# Altium schematic sheet Kajtuś-DSP_processor.SchDoc
size A4; DocumentNumber: 8; SheetNumber: 8; SheetTotal: 9
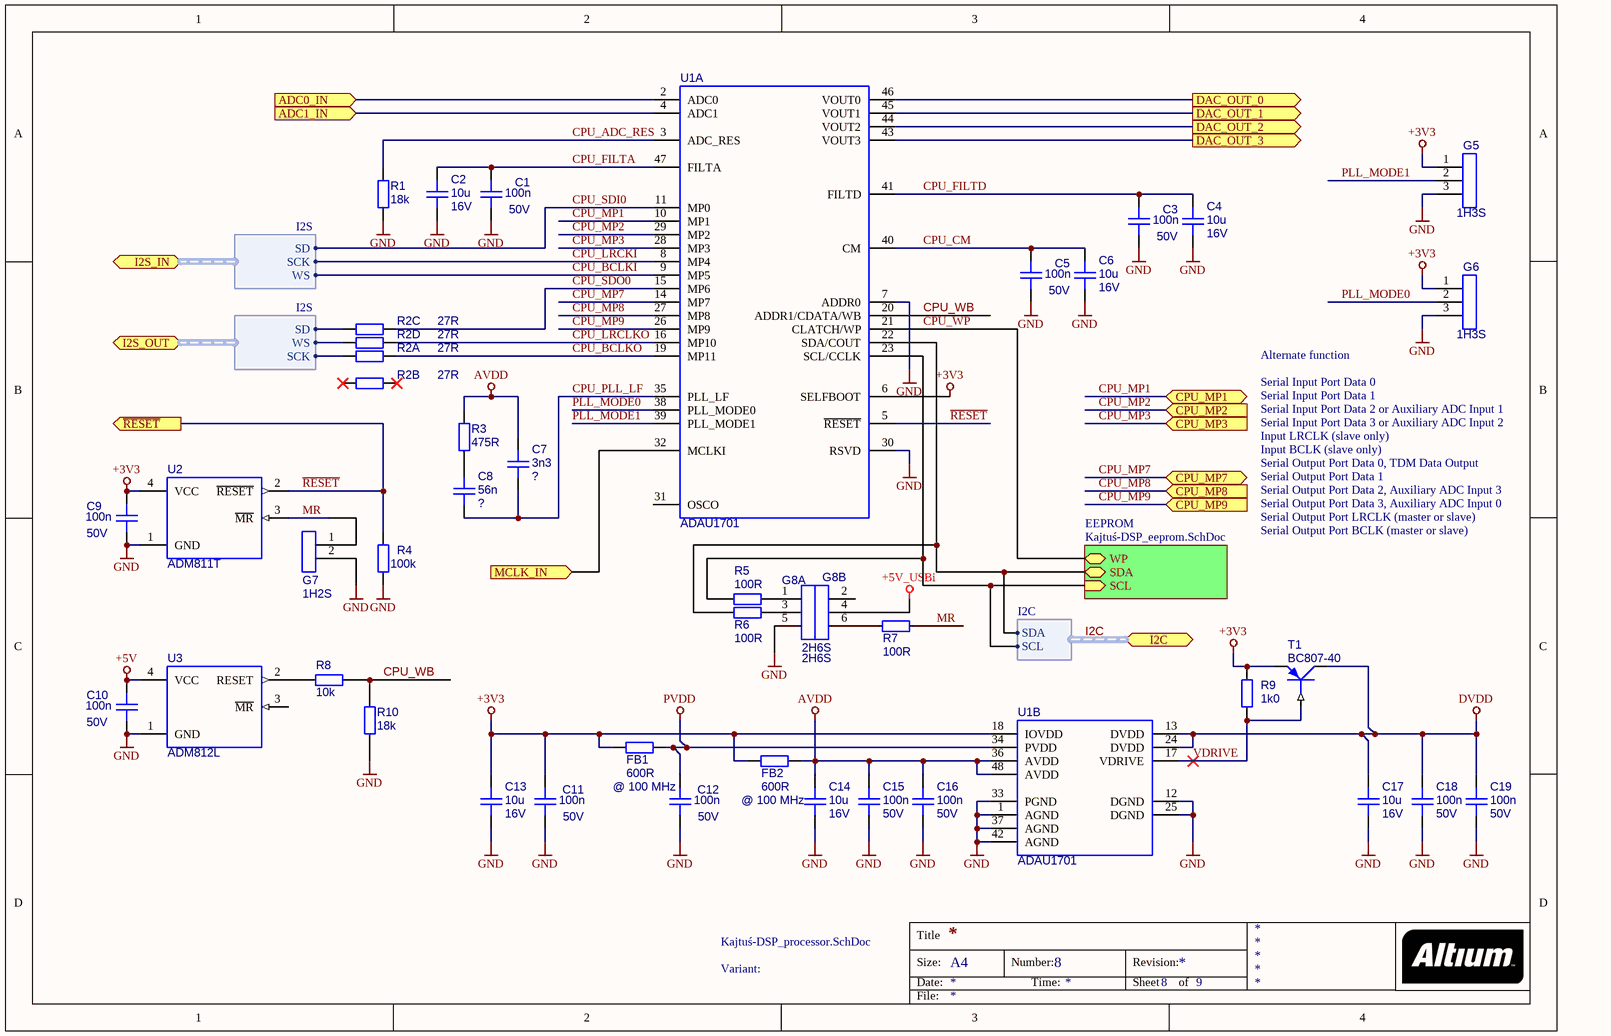
[diagram p0: Kajtuś-DSP_processor.SchDoc]

## Parts
C1  value 100n  Voltage: 50V  [C_0603_MA]  (hidden comment: C_0603_100n_50V_X7R)
C2  value 10u  Voltage: 16V  [C_0805_MA]  (hidden comment: C_0805_10u_16V_X5R)
C3  value 100n  Voltage: 50V  [C_0603_MA]  (hidden comment: C_0603_100n_50V_X7R)
C4  value 10u  Voltage: 16V  [C_0805_MA]  (hidden comment: C_0805_10u_16V_X5R)
C5  value 100n  Voltage: 50V  [C_0603_MA]  (hidden comment: C_0603_100n_50V_X7R)
C6  value 10u  Voltage: 16V  [C_0805_MA]  (hidden comment: C_0805_10u_16V_X5R)
C7  3n3  [C_0603_MA]
C8  56n  [C_0603_MA]
C9  value 100n  Voltage: 50V  [C_0603_MA]  (hidden comment: C_0603_100n_50V_X7R)
C10  value 100n  Voltage: 50V  [C_0603_MA]  (hidden comment: C_0603_100n_50V_X7R)
C11  value 100n  Voltage: 50V  [C_0603_MA]  (hidden comment: C_0603_100n_50V_X7R)
C12  value 100n  Voltage: 50V  [C_0603_MA]  (hidden comment: C_0603_100n_50V_X7R)
C13  value 10u  Voltage: 16V  [C_0805_MA]  (hidden comment: C_0805_10u_16V_X5R)
C14  value 10u  Voltage: 16V  [C_0805_MA]  (hidden comment: C_0805_10u_16V_X5R)
C15  value 100n  Voltage: 50V  [C_0603_MA]  (hidden comment: C_0603_100n_50V_X7R)
C16  value 100n  Voltage: 50V  [C_0603_MA]  (hidden comment: C_0603_100n_50V_X7R)
C17  value 10u  Voltage: 16V  [C_0805_MA]  (hidden comment: C_0805_10u_16V_X5R)
C18  value 100n  Voltage: 50V  [C_0603_MA]  (hidden comment: C_0603_100n_50V_X7R)
C19  value 100n  Voltage: 50V  [C_0603_MA]  (hidden comment: C_0603_100n_50V_X7R)
FB1  value 600R  @ Frequency: @ 100 MHz  [R_0603_MA]  (hidden comment: FB_0603_PBY160808T-601Y_600R_1A)
FB2  value 600R  @ Frequency: @ 100 MHz  [R_0603_MA]  (hidden comment: FB_0603_PBY160808T-601Y_600R_1A)
G5  value 1H3S  [1H3S_FHS]  (hidden comment: G_1H3S)
G6  value 1H3S  [1H3S_FHS]  (hidden comment: G_1H3S)
G7  value 1H2S  [1H2S_FHS]  (hidden comment: G_1H2S)
G8  value 2H6S  [2H6S]  (hidden comment: G_2H6S)  (parts A,B of 2)
R1  18k  [R_1206_MA]
R2  27R  [RA_1206]  (parts A,B,C,D of 4)
R3  475R  [R_0603_MA]
R4  value 100k  [R_0603_MA]  (hidden comment: R_0603_100k_5%)
R5  value 100R  [R_0603_MA]  (hidden comment: R_0603_100R_5%)
R6  value 100R  [R_0603_MA]  (hidden comment: R_0603_100R_5%)
R7  value 100R  [R_0603_MA]  (hidden comment: R_0603_100R_5%)
R8  value 10k  [R_0603_MA]  (hidden comment: R_0603_10k_5%)
R9  value 1k0  [R_0603_MA]  (hidden comment: R_0603_1k0_5%)
R10  18k  [R_0603_MA]
T1  BC807-40  [SOT-23]
U1  ADAU1701  [TSQFP50P900X900X160-48N]  (parts A,B of 2)
U2  ADM811T  [SOT-143]
U3  ADM812L  [SOT-143]

## Sub-sheets
EEPROM = Kajtuś-DSP_eeprom.SchDoc: SCL (in), SDA (bidir), WP (bidir)

## Ports
ADC0_IN (in), ADC1_IN (in), CPU_MP1, CPU_MP2 (in), CPU_MP3 (in), CPU_MP7, CPU_MP8 (in), CPU_MP9 (in), DAC_OUT_0 (out), DAC_OUT_1 (out), DAC_OUT_2 (out), DAC_OUT_3 (out), I2C (harness I2C), I2S_IN (harness I2S), I2S_OUT (harness I2S), MCLK_IN (in), ~{RESET} (out)

## Harnesses
I2S: SD, SCK, WS
I2C: SDA, SCL

## Nets
+3V3: C9.1 C11.1 C13.1 FB1.1 FB2.1 G5.1 G6.1 R9.1 T1.2(E) U1.6(SELFBOOT) U1.18(IOVDD) U2.4(VCC)
+5V: C10.1 U3.4(VCC)
+5V_USBi: G8.4
AVDD: C7.1 C14.1 C15.1 C16.1 FB2.2 R3.1 U1.36(AVDD) U1.48(AVDD)
DVDD: C17.1 C18.1 C19.1 T1.3(C) U1.13(DVDD) U1.24(DVDD)
GND: C1.2 C2.2 C3.2 C4.2 C5.2 C6.2 C9.2 C10.2 C11.2 C12.2 C13.2 C14.2 C15.2 C16.2 C17.2 C18.2 C19.2 G5.3 G6.3 G7.2 G8.5 R1.2 R4.2 R10.2 U1.1(AGND) U1.7(ADDR0) U1.12(DGND) U1.25(DGND) U1.30(RSVD) U1.33(PGND) U1.37(AGND) U1.42(AGND) U2.1(GND) U3.1(GND)
PVDD: C12.1 FB1.2 U1.34(PVDD)
ADC0_IN: U1.2(ADC0) ; port ADC0_IN
ADC1_IN: U1.4(ADC1) ; port ADC1_IN
CPU_ADC_RES: R1.1 U1.3(ADC_RES)
CPU_BCLKI: U1.9(MP5) ; port I2S_IN.WS
CPU_BCLKO: R2.5 U1.19(MP11)
CPU_CM: C5.1 C6.1 U1.40(CM)
CPU_FILTA: C1.1 C2.1 U1.47(FILTA)
CPU_FILTD: C3.1 C4.1 U1.41(FILTD)
CPU_LRCKI: U1.8(MP4) ; port I2S_IN.SCK
CPU_LRCLKO: R2.8 U1.16(MP10)
CPU_MP1: U1.10(MP1) ; port CPU_MP1
CPU_MP2: U1.29(MP2) ; port CPU_MP2
CPU_MP3: U1.28(MP3) ; port CPU_MP3
CPU_MP7: U1.14(MP7) ; port CPU_MP7
CPU_MP8: U1.27(MP8) ; port CPU_MP8
CPU_MP9: U1.26(MP9) ; port CPU_MP9
CPU_PLL_LF: C7.2 C8.2 U1.35(PLL_LF)
CPU_SDI0: U1.11(MP0) ; port I2S_IN.SD
CPU_SDO0: R2.7 U1.15(MP6)
CPU_WB: R8.2 R10.1 U1.20(ADDR1/CDATA/WB)
CPU_WP: U1.21(CLATCH/WP) ; sheet EEPROM/WP
DAC_OUT_0: U1.46(VOUT0) ; port DAC_OUT_0
DAC_OUT_1: U1.45(VOUT1) ; port DAC_OUT_1
DAC_OUT_2: U1.44(VOUT2) ; port DAC_OUT_2
DAC_OUT_3: U1.43(VOUT3) ; port DAC_OUT_3
I2C.SCL: R5.1 U1.23(SCL/CCLK) ; sheet EEPROM/SCL, port I2C.SCL
I2C.SDA: R6.1 U1.22(SDA/COUT) ; sheet EEPROM/SDA, port I2C.SDA
MCLK_IN: U1.32(MCLKI) ; port MCLK_IN
MR: G7.1 R7.2 U2.3(~{MR})
PLL_MODE0: G6.2 U1.38(PLL_MODE0)
PLL_MODE1: G5.2 U1.39(PLL_MODE1)
~{RESET}: R4.1 U1.5(~{RESET}) U2.2(~{RESET}) ; port ~{RESET}
VDRIVE: R9.2 T1.1(B) U1.17(VDRIVE)
NetC8_1: C8.1 R3.2
NetG8_1: G8.1 R5.2
NetG8_3: G8.3 R6.2
NetG8_6: G8.6 R7.1
NetR2_1: R2.1 ; port I2S_OUT.SCK
NetR2_3: R2.3 ; port I2S_OUT.SD
NetR2_4: R2.4 ; port I2S_OUT.WS
NetR8_1: R8.1 U3.2(RESET)

Not connected (* = marked no-connect by the designer): G8 2; R2 2* 6*; U1 31(OSCO); U3 3(~{MR})

## Buses and harness runs
harness I2C = port I2C

## Notes on the sheet
- Serial Input Port Data 0
- Alternate function
- Serial Input Port Data 1
- Serial Input Port Data 2 or Auxiliary ADC Input 1
- Serial Input Port Data 3 or Auxiliary ADC Input 2
- Input LRCLK (slave only)
- Input BCLK (slave only)
- Serial Output Port Data 0, TDM Data Output
- Serial Output Port Data 1
- Serial Output Port Data 2, Auxiliary ADC Input 3
- Serial Output Port Data 3, Auxiliary ADC Input 0
- Serial Output Port LRCLK (master or slave)
- Serial Output Port BCLK (master or slave)
- Variant:
- Title
- Size:
- Date:
- A4
- Number:
- Time:
- Revision:
- Sheet
- of
- File:

## Library data of the parts
C1 C3 C5 C9-C12 C15 C16 C18 C19 = C_0603_100n_50V_X7R: Kondensator ceramiczny SMD; Vendor: TME; Part Number: C_0603_100n_50V_X7R
C2 C4 C6 C13 C14 C17 = C_0805_10u_16V_X5R: Kondensator ceramiczny SMD; Vendor: TME; Part Number: C_0805_10u_16V_X5R
C7 C8 = C_SMD_MLCC_generic: Kondensator ceramiczny SMD; Vendor: ?; Part Number: C_SMD_MLCC_generic; Voltage: ?
  C7: Value: 3n3
  C8: Value: 56n
FB1 FB2 = FB_0603_PBY160808T-601Y_600R_1A: Koralik ferrytowy; Manufacturer: Yageo; Vendor: TME; Part Number: FB_0603_PBY160808T-601Y_600R_1A; Vendor Part Name: PBY160808T-601Y; Manufacturer Part Number: PBY160808T-601Y
G5 G6 = G_1H3S: Listwa jednorzędowa, 1x3 piny, raster 2,54mm; Manufacturer: generic; Vendor: TME; Part Number: G_1H3S
G7 = G_1H2S: Listwa jednorzędowa, 1x2 piny, raster 2,54mm; Manufacturer: generic; Vendor: TME; Part Number: G_1H2S
G8 = G_2H6S: Listwa kołkowa; Manufacturer: Ninigi; Vendor: TME; Part Number: G_2H6S
R1 R3 R10 = R_SMD_generic: SMD resistor; Part Number: ?; Vendor: ?; Manufacturer: ?; Tolerance: ?
  R1 R10: Value: 18k
  R3: Value: 475R
R2 = RA_1206_4x27R_5%: SMD Resistor Array, 1206, 4x27R, 5%, 62.5mW; Parametry: 4x27R; 5%; 1/16W;; Producent: Yageo; Oznaczenie: YC164-JR0727RL; TCR: 200ppm; Package: 1206, YC164; Tolerance: 5%; Value: 27R
R4 = R_0603_100k_5%: Rezystor SMD; Manufacturer: Royal Ohm; Vendor: TME; Tolerance: 5%; Part Number: R_0603_100k_5%
R5-R7 = R_0603_100R_5%: Rezystor SMD; Manufacturer: Royal Ohm; Vendor: TME; Tolerance: 5%; Part Number: R_0603_100R_5%
R8 = R_0603_10k_5%: Rezystor SMD; Manufacturer: Royal Ohm; Vendor: TME; Tolerance: 5%; Part Number: R_0603_10k_5%
R9 = R_0603_1k0_5%: Rezystor SMD; Manufacturer: Royal Ohm; Vendor: TME; Tolerance: 5%; Part Number: R_0603_1k0_5%
T1 = T_SOT-23_BC807-40: Tranzystor bipolarny PNP; Manufacturer: NXP; Vendor: TME; Part Number: T_SOT-23_BC807-40; Value: BC807-40
U1 = U_ADAU1701: SigmaDSP 28-/56-Bit Audio Processor with Two ADCs and Four DACs; Manufacturer: Analog Devices; Manufacturer Part Number: ADAU1701; Package: LQFP-48
U2 = U_ADM811T: Microprocessor Supervisory Circuit in 4-Lead SOT-143 with DSP; Manufacturer: Analog Devices; Manufacturer Part Number: ADM811T; Package: SOT-143
U3 = U_ADM812L: Microprocessor Supervisory Circuit in 4-Lead SOT-143 with DSP; Manufacturer: Analog Devices; Manufacturer Part Number: ADM812L; Package: SOT-143